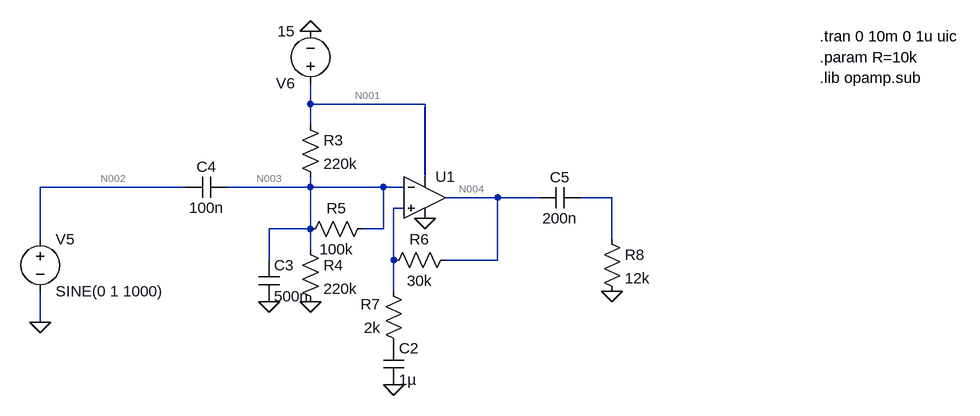
[diagram p0: schematic estudo2.asc]
estudo2.asc, the LTspice schematic file:
Version 4.1
SHEET 1 1364 708
WIRE -176 -912 -176 -944
WIRE 0 -912 -176 -912
WIRE -176 -880 -176 -912
WIRE 0 -800 0 -912
WIRE -368 -784 -592 -784
WIRE -176 -784 -176 -800
WIRE -176 -784 -304 -784
WIRE -64 -784 -176 -784
WIRE -32 -784 -64 -784
WIRE 112 -768 32 -768
WIRE 176 -768 112 -768
WIRE 288 -768 240 -768
WIRE -32 -752 -48 -752
WIRE -176 -720 -176 -784
WIRE -176 -720 -240 -720
WIRE -64 -720 -64 -784
WIRE -64 -720 -96 -720
WIRE -592 -704 -592 -784
WIRE 288 -704 288 -768
WIRE -176 -688 -176 -720
WIRE -240 -672 -240 -720
WIRE -48 -672 -48 -752
WIRE 112 -672 112 -768
WIRE 112 -672 32 -672
WIRE -48 -624 -48 -672
WIRE -592 -576 -592 -624
FLAG -592 -576 0
FLAG -176 -1024 0
FLAG -240 -608 0
FLAG -176 -608 0
FLAG 0 -736 0
FLAG -48 -480 0
FLAG 288 -624 0
SYMBOL OpAmps\\UniversalOpAmp2 0 -768 R0
SYMATTR InstName U1
SYMBOL voltage -592 -720 R0
WINDOW 123 0 0 Left 0
WINDOW 39 0 0 Left 0
SYMATTR InstName V5
SYMATTR Value SINE(0 1 1000)
SYMBOL voltage -176 -928 R180
WINDOW 123 0 0 Left 0
WINDOW 39 0 0 Left 0
SYMATTR InstName V6
SYMATTR Value 15
SYMBOL res -192 -896 R0
SYMATTR InstName R3
SYMATTR Value 220k
SYMBOL res -192 -704 R0
SYMATTR InstName R4
SYMATTR Value 220k
SYMBOL res -80 -736 R90
WINDOW 0 0 56 VBottom 2
WINDOW 3 32 56 VTop 2
SYMATTR InstName R5
SYMATTR Value 100k
SYMBOL res 48 -688 R90
WINDOW 0 0 56 VBottom 2
WINDOW 3 32 56 VTop 2
SYMATTR InstName R6
SYMATTR Value 30k
SYMBOL res -32 -528 R180
WINDOW 0 36 76 Left 2
WINDOW 3 36 40 Left 2
SYMATTR InstName R7
SYMATTR Value 2k
SYMBOL cap -64 -544 R0
SYMATTR InstName C2
SYMATTR Value 1µ
SYMBOL cap -256 -672 R0
SYMATTR InstName C3
SYMATTR Value 500n
SYMBOL cap -304 -800 R90
WINDOW 0 0 32 VBottom 2
WINDOW 3 32 32 VTop 2
SYMATTR InstName C4
SYMATTR Value 100n
SYMBOL cap 240 -784 R90
WINDOW 0 0 32 VBottom 2
WINDOW 3 32 32 VTop 2
SYMATTR InstName C5
SYMATTR Value 200n
SYMBOL res 272 -720 R0
SYMATTR InstName R8
SYMATTR Value 12k
TEXT 608 -1016 Left 2 !.tran 0 10m 0 1u uic
TEXT 608 -984 Left 2 !.param R=10k
TEXT 608 -952 Left 2 !.lib opamp.sub

The netlist it stands for:
* estudo2.asc
X§U1 N006 N003 N001 0 N004 level2 Avol=1Meg GBW=10Meg Slew=10Meg Ilimit=25m Rail=0 Vos=0 En=0 Enk=0 In=0 Ink=0 Rin=500Meg  ; pins In+ In- V+ V- OUT
V5 N002 0 SINE(0 1 1000)
V6 N001 0 15
R3 N001 N003 220k
R4 N003 0 220k
R5 N003 N003 100k
R6 N004 N006 30k
R7 P001 N006 2k
C2 P001 0 1µ
C3 N003 0 500n
C4 N003 N002 100n
C5 N005 N004 200n
R8 N005 0 12k
.tran 0 10m 0 1u uic
.param R=10k
.lib opamp.sub
.lib UniversalOpAmp2.lib
.backanno
.end

* Results of the author's LTspice run, read from the files saved beside the schematic
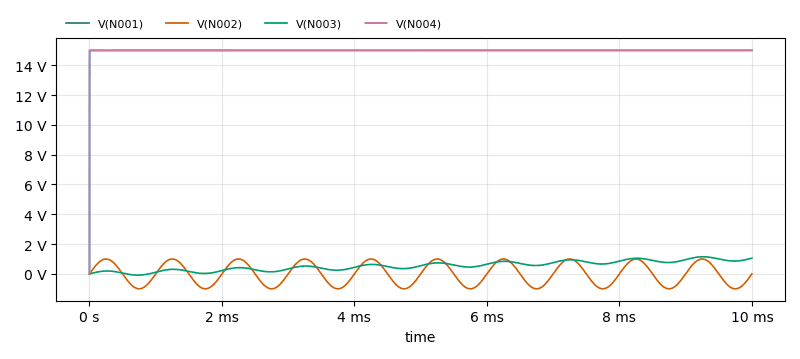
[diagram p1: Transient Analysis of estudo2.asc, plotted from the saved traces]
* Transient Analysis, 1 run:
*   V(N001): min 0 V, max 15 V, average 15 V, rms 15 V, last 15 V
*   V(N002): min -1 V, max 1 V, average 0 V, rms 707.1 mV, last 0 V
*   V(N003): min -83.3 mV, max 1.148 V, average 540.3 mV, rms 626.8 mV, last 1.055 V
*   V(N004): min 0 V, max 15 V, average 14.99 V, rms 14.99 V, last 15 V